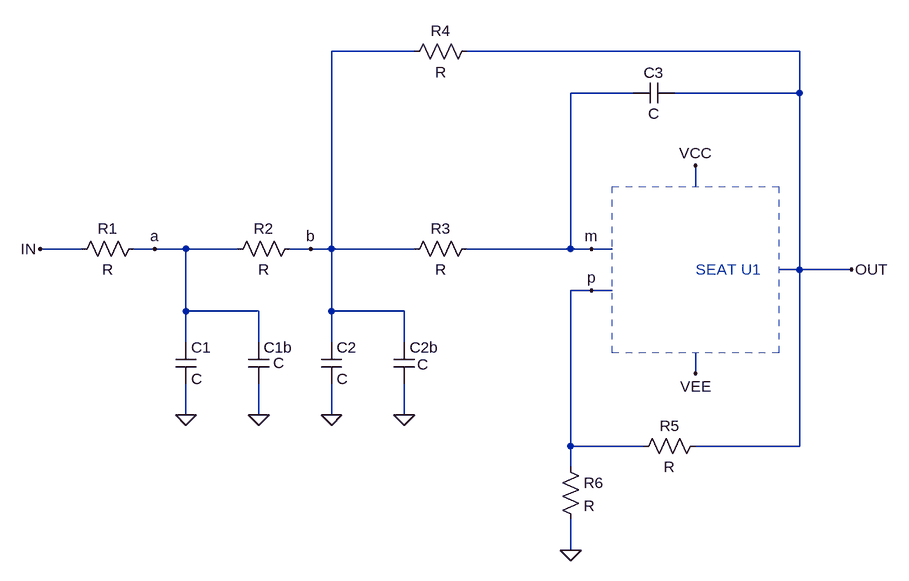
[diagram p0: schematic MFB_LP.asc]
MFB_LP.asc, the LTspice schematic file:
Version 4.1
SHEET 1 2076 708
WIRE -128 -80 -256 -80
WIRE 464 -80 -48 -80
WIRE 208 -16 112 -16
WIRE 464 -16 464 -80
WIRE 464 -16 272 -16
WIRE 304 128 304 96
WIRE -640 224 -704 224
WIRE -528 224 -560 224
WIRE -480 224 -528 224
WIRE -400 224 -480 224
WIRE -288 224 -320 224
WIRE -256 224 -256 -80
WIRE -256 224 -288 224
WIRE -128 224 -256 224
WIRE 112 224 112 -16
WIRE 112 224 -48 224
WIRE 144 224 112 224
WIRE 176 224 144 224
WIRE 464 256 464 -16
WIRE 464 256 432 256
WIRE 544 256 464 256
WIRE 144 288 112 288
WIRE 176 288 144 288
WIRE -480 320 -480 224
WIRE -368 320 -480 320
WIRE -256 320 -256 224
WIRE -144 320 -256 320
WIRE -480 368 -480 320
WIRE -368 368 -368 320
WIRE -256 368 -256 320
WIRE -144 368 -144 320
WIRE 304 416 304 384
WIRE -480 480 -480 432
WIRE -368 480 -368 432
WIRE -256 480 -256 432
WIRE -144 480 -144 432
WIRE 112 528 112 288
WIRE 224 528 112 528
WIRE 464 528 464 256
WIRE 464 528 304 528
WIRE 112 560 112 528
WIRE 112 688 112 640
FLAG 544 256 OUT
FLAG 304 96 VCC
FLAG 304 416 VEE
FLAG 144 224 m
FLAG 144 288 p
FLAG -528 224 a
FLAG -704 224 IN
FLAG -288 224 b
FLAG 112 688 0
FLAG -480 480 0
FLAG -368 480 0
FLAG -256 480 0
FLAG -144 480 0
SYMBOL res -544 208 R90
WINDOW 0 0 56 VBottom 2
WINDOW 3 32 56 VTop 2
SYMATTR InstName R1
SYMBOL res -304 208 R90
WINDOW 0 0 56 VBottom 2
WINDOW 3 32 56 VTop 2
SYMATTR InstName R2
SYMBOL res -32 -96 R90
WINDOW 0 0 56 VBottom 2
WINDOW 3 32 56 VTop 2
SYMATTR InstName R4
SYMBOL res 96 544 R0
SYMATTR InstName R6
SYMBOL res 320 512 R90
WINDOW 0 0 56 VBottom 2
WINDOW 3 32 56 VTop 2
SYMATTR InstName R5
SYMBOL cap -496 368 R0
SYMATTR InstName C1
SYMBOL cap -272 368 R0
SYMATTR InstName C2
SYMBOL cap 272 -32 R90
WINDOW 0 0 32 VBottom 2
WINDOW 3 32 32 VTop 2
SYMATTR InstName C3
SYMBOL cap -384 368 R0
WINDOW 3 38 32 Left 2
SYMATTR InstName C1b
SYMBOL cap -160 368 R0
WINDOW 3 36 34 Left 2
SYMATTR InstName C2b
SYMBOL res -32 208 R90
WINDOW 0 0 56 VBottom 2
WINDOW 3 32 56 VTop 2
SYMATTR InstName R3
TEXT 304 256 Left 2 ;SEAT U1
RECTANGLE Normal 176 128 432 384 2

The netlist it stands for:
* MFB_LP.asc
R1 a IN R
R2 b a R
R4 OUT b R
R6 p 0 R
R5 OUT p R
C1 a 0 C
C2 b 0 C
C3 OUT m C
C1b a 0 C
C2b b 0 C
R3 m b R
* SEAT U1
.backanno
.end